# EasyEDA schematic 7-seg_display.json
TITLE: 8-Channel 7-Segment Display; REV: 1.0; Date: 2026-06-13; Sheet: 1/1; Drawn By: Vivek Pawar
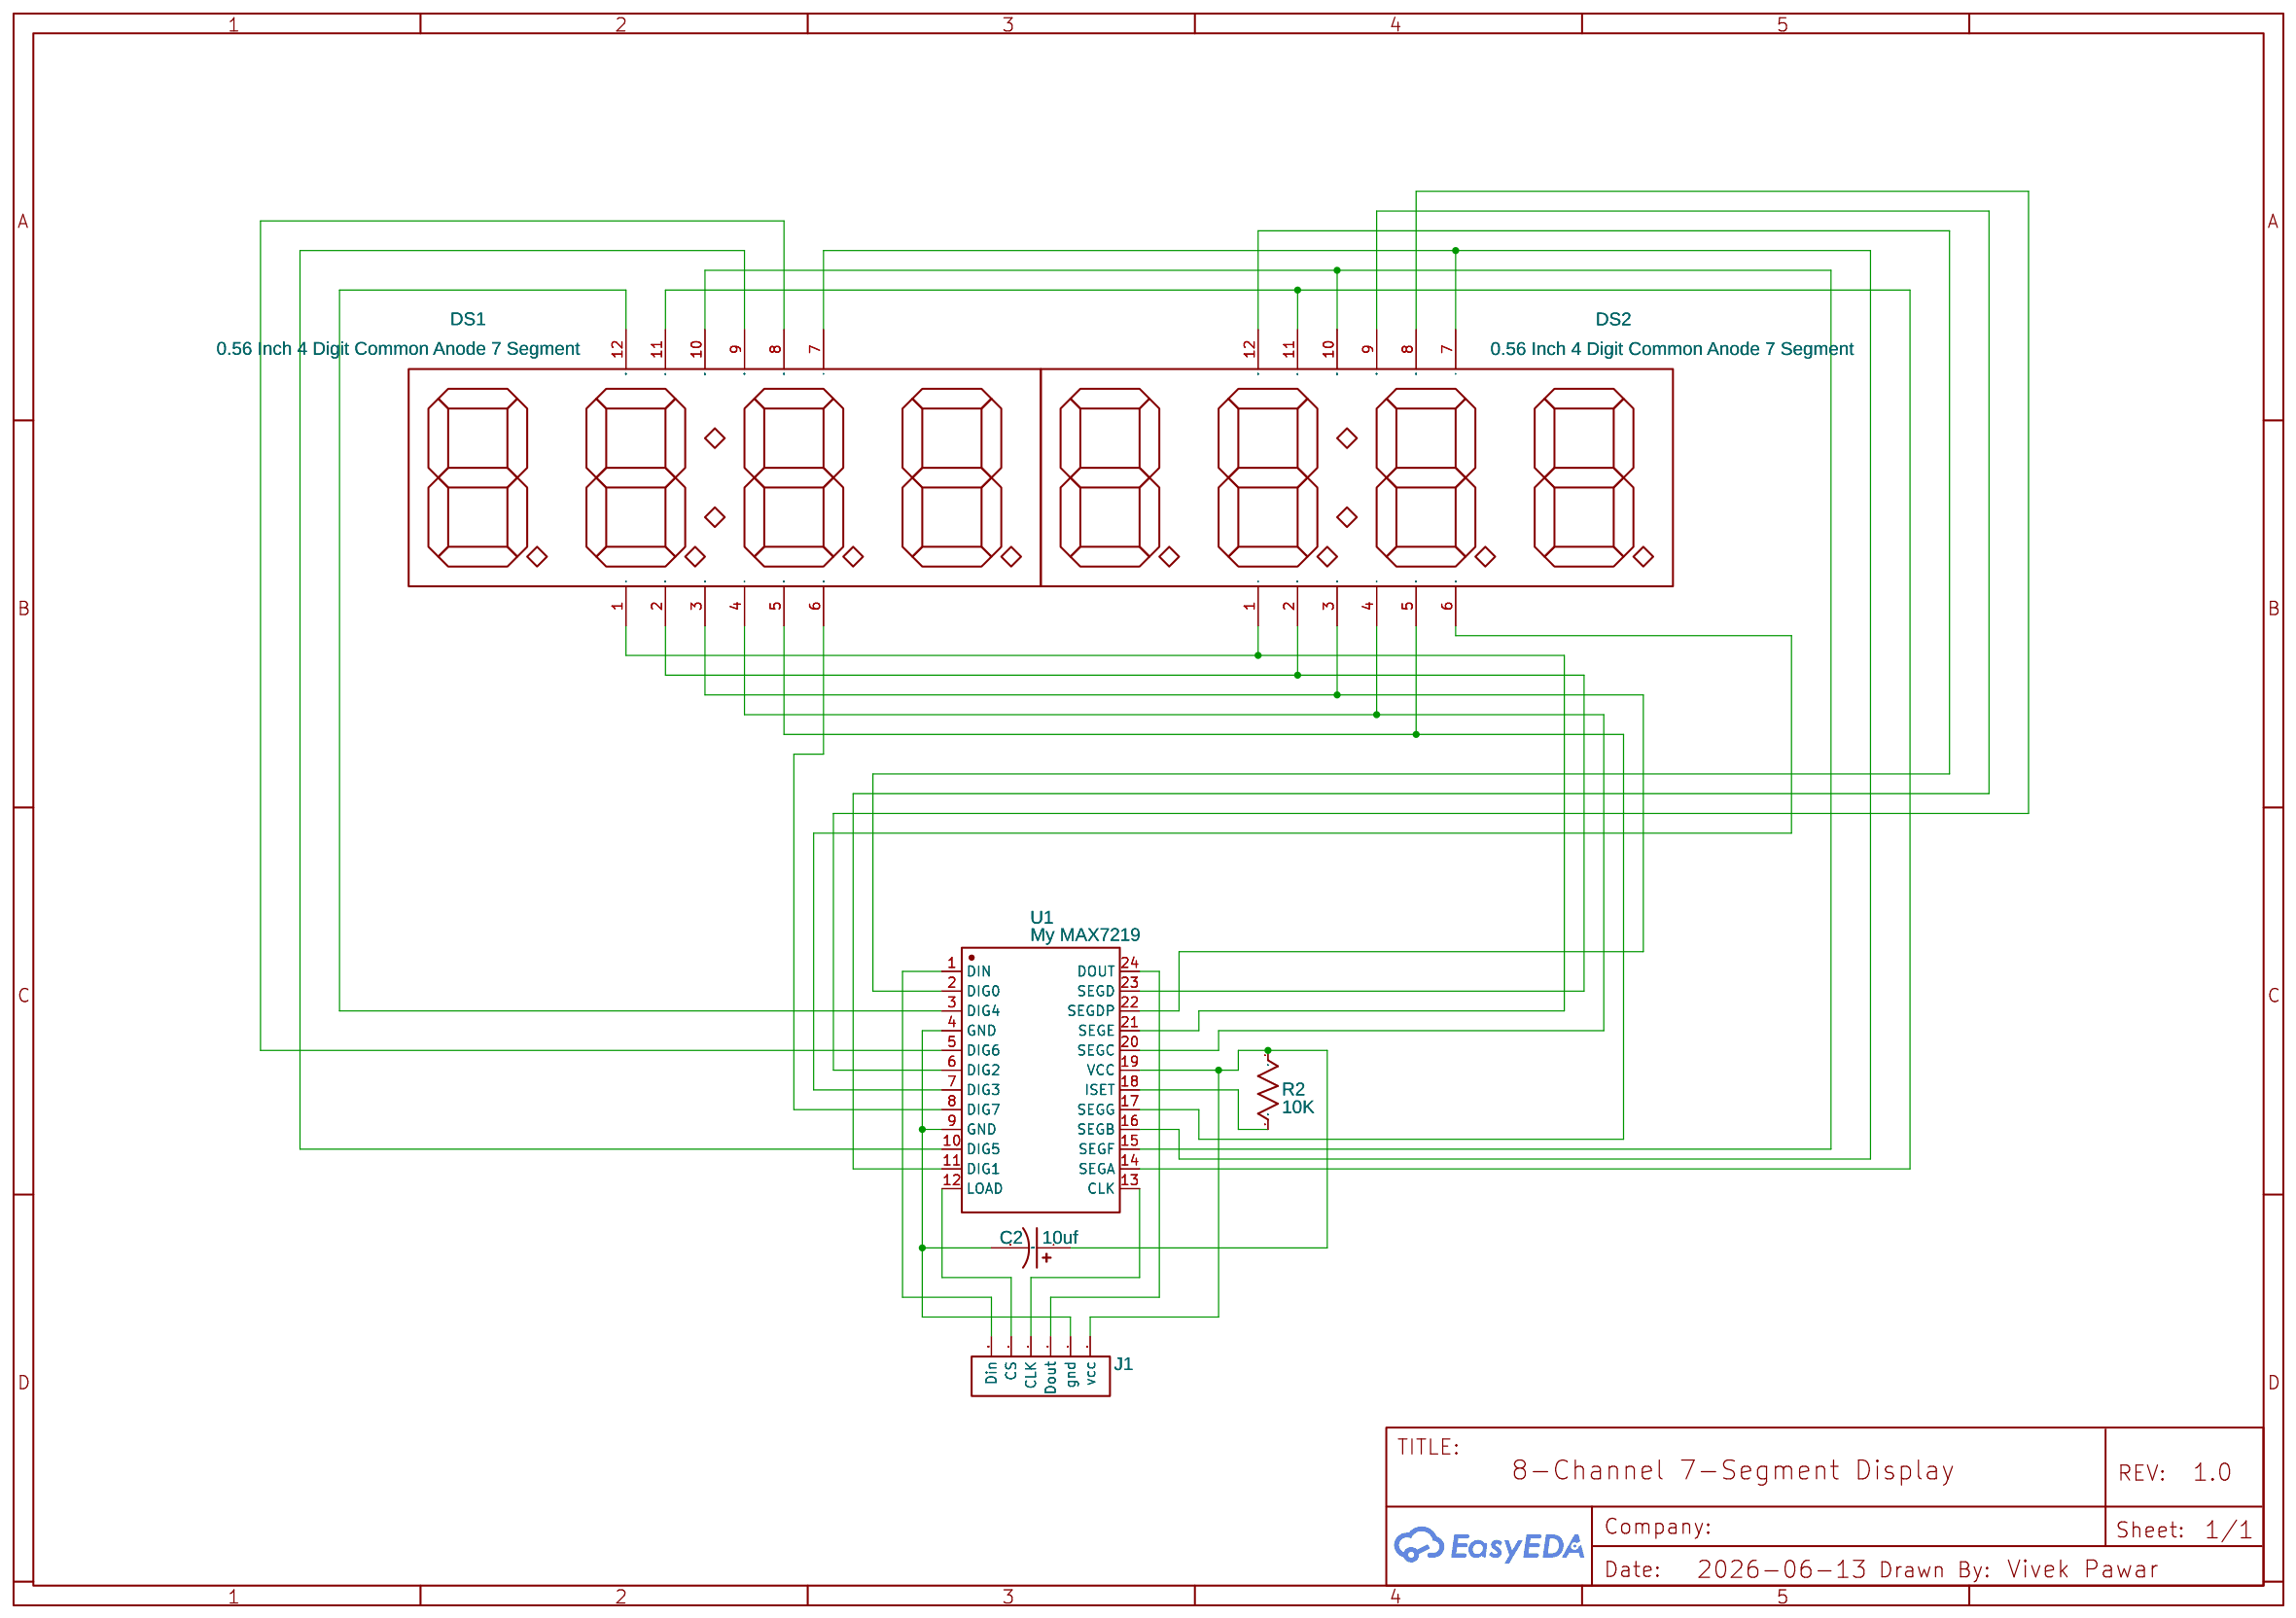
[diagram p0: schematic sheet]

## Parts
C2  10uf  [CAP-D3.0×F1.5]
DS1  0.56 Inch 4 Digit Common Anode 7 Segment  [0.56 INCH 4 DIGIT COMMON ANODE 7 SEGMENT DISPLAY CLOCK]
DS2  0.56 Inch 4 Digit Common Anode 7 Segment  [0.56 INCH 4 DIGIT COMMON ANODE 7 SEGMENT DISPLAY CLOCK]
J1  HDR-M-2.54_1x6  [HDR-M-2.54_1X6]
R2  10K  [R0603]
U1  My MAX7219  [MY MAX7219]

## Library data of the parts
C2 = CE_TH_D3.0×F1.5_US: Contributor: LCEDA_Lib
DS1 DS2 = 0.56 Inch 4 Digit Common Anode 7 Segment: Manufacturer Part: 0.56 Inch 4 Digit Common Anode 7 Segment Display Clock; Contributor: shabbir.ahsan
J1 = HDR-M-2.54_1x6: Supplier Part: C190819; Supplier: LCSC; Contributor: LCEDA_Lib
R2 = R_0603_US: Contributor: LCEDA_Lib
U1 = My MAX7219

## Nets
Net-(C2-1): C2.1 J1.1(vcc) R2.1 U1.19(VCC)
Net-(C2-2): C2.2 J1.2(gnd) U1.4(GND) U1.9(GND)
Net-(DS1-1): DS1.1 DS2.1 U1.21(SEGE)
Net-(DS1-2): DS1.2 DS2.2 U1.23(SEGD)
Net-(DS1-3): DS1.3 DS2.3 U1.22(SEGDP)
Net-(DS1-4): DS1.4 DS2.4 U1.20(SEGC)
Net-(DS1-5): DS1.5 DS2.5 U1.17(SEGG)
Net-(DS1-6): DS1.6 U1.8(DIG7)
Net-(DS1-7): DS1.7 DS2.7 U1.16(SEGB)
Net-(DS1-8): DS1.8 U1.5(DIG6)
Net-(DS1-9): DS1.9 U1.10(DIG5)
Net-(DS1-10): DS1.10 DS2.10 U1.15(SEGF)
Net-(DS1-11): DS1.11 DS2.11 U1.14(SEGA)
Net-(DS1-12): DS1.12 U1.3(DIG4)
Net-(DS2-6): DS2.6 U1.7(DIG3)
Net-(DS2-8): DS2.8 U1.6(DIG2)
Net-(DS2-9): DS2.9 U1.11(DIG1)
Net-(DS2-12): DS2.12 U1.2(DIG0)
Net-(J1-3): J1.3(Dout) U1.24(DOUT)
Net-(J1-4): J1.4(CLK) U1.13(CLK)
Net-(J1-5): J1.5(CS) U1.12(LOAD)
Net-(J1-6): J1.6(Din) U1.1(DIN)
Net-(R2-2): R2.2 U1.18(ISET)
